# Altium schematic sheet 02-cpu+connect.SchDoc
size A4; SheetNumber: 3; SheetTotal: 4
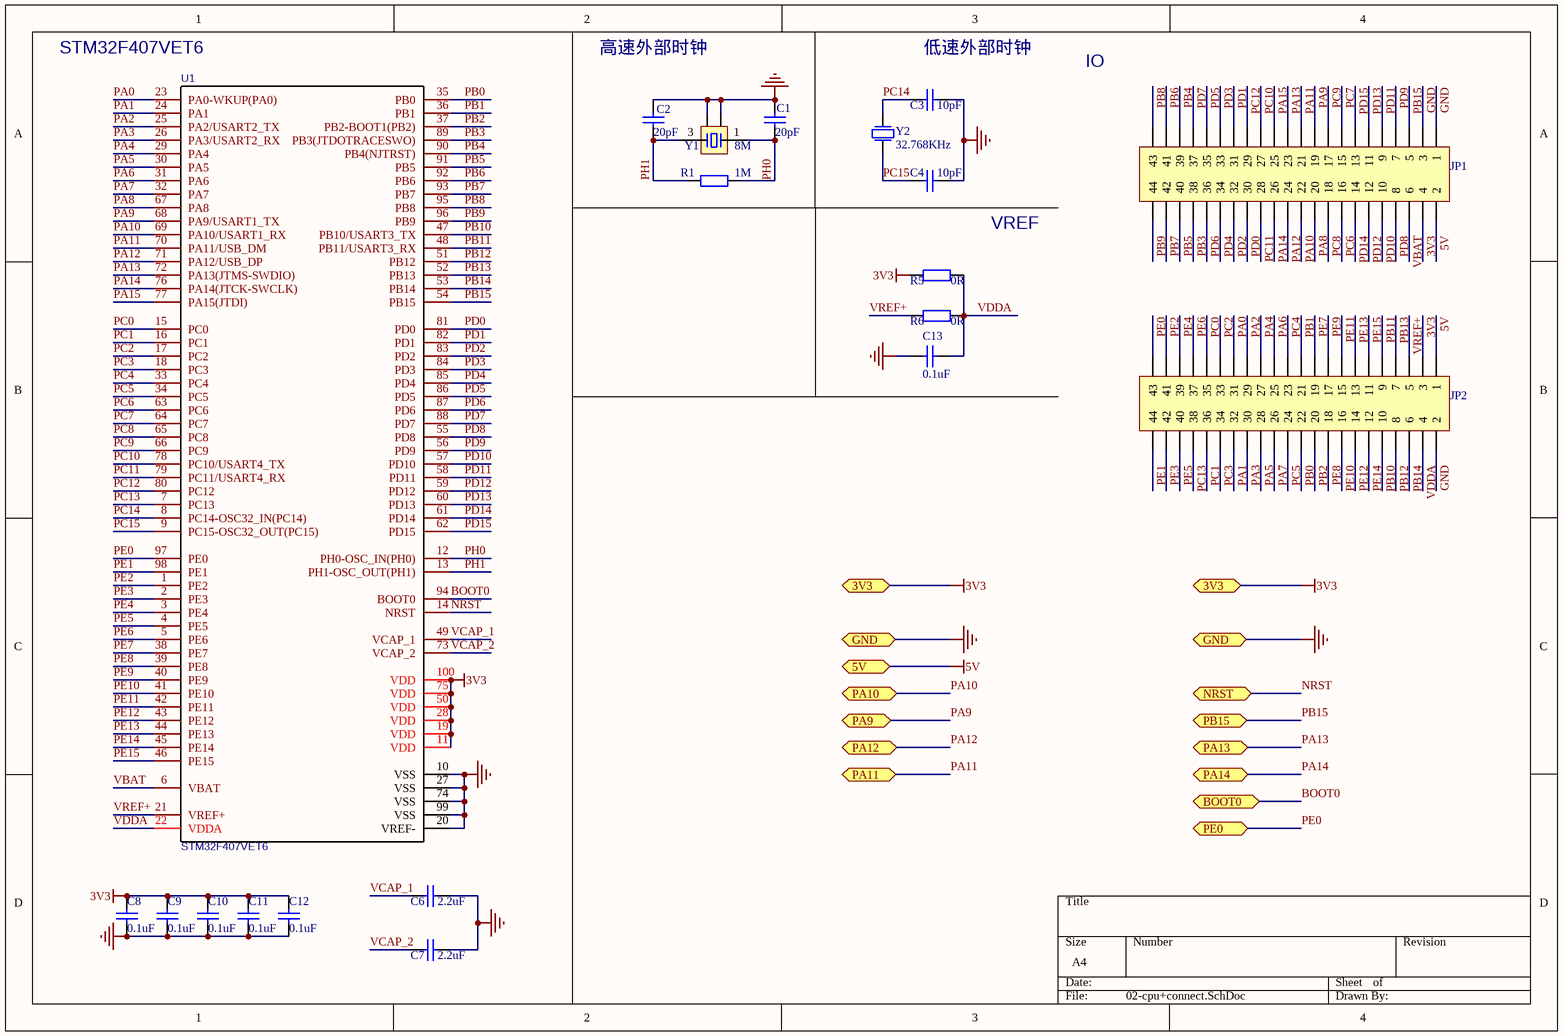
[diagram p0: 02-cpu+connect.SchDoc]

## Parts
C1  20pF  [C 0402_L]
C2  20pF  [C 0402_L]
C3  10pF  [C 0402_L]
C4  10pF  [C 0402_L]
C6  2.2uF  [C 0402_L]
C7  2.2uF  [C 0402_L]
C8  0.1uF  [C 0402_L]
C9  0.1uF  [C 0402_L]
C10  0.1uF  [C 0402_L]
C11  0.1uF  [C 0402_L]
C12  0.1uF  [C 0402_L]
C13  0.1uF  [C 0402_L]
JP1  Header 2x22  [HDR2.54-LI-2x22P]  (value not drawn)
JP2  Header 2x22  [HDR2.54-LI-2x22P]  (value not drawn)
R1  1M  [R 0402_L]
R5  0R  [R 0402_L]
R6  0R  [R 0402_L]
U1  STM32F407VET6  [LQFP100 14x14_N]
Y1  8M  [OSC 3225-4P]
Y2  32.768KHz  [FC135-3.2X1.5]

## Ports
3V3 (bidir, see Main[3A], 01-PWR[1A], 03-key+led+swd[1A]), 5V (bidir, see Main[3B], 01-PWR[1A]), BOOT0 (bidir, see Main[2B], 03-key+led+swd[1B]), GND (bidir, see Main[3A], 03-key+led+swd[1A]), NRST (bidir, see Main[2B], 03-key+led+swd[1B]), PA9 (bidir, see Main[2A], 01-PWR[1B]), PA10 (bidir, see Main[2A], 01-PWR[1A]), PA11 (bidir, see Main[2A], 01-PWR[1B]), PA12 (bidir, see Main[2A], 01-PWR[1B]), PA13 (bidir, see Main[2B], 03-key+led+swd[1B]), PA14 (bidir, see Main[2B], 03-key+led+swd[1B]), PB15 (bidir, see Main[2B], 03-key+led+swd[1B]), PE0 (bidir, see Main[2B], 03-key+led+swd[1B])

## Nets
3V3: C8.1 C9.1 C10.1 C11.1 C12.1 JP1.4 JP2.3 R5.2 U1.11(VDD) U1.19(VDD) U1.28(VDD) U1.50(VDD) U1.75(VDD) U1.100(VDD) ; port 3V3
5V: JP1.2 JP2.1 ; port 5V
GND: C1.1 C2.1 C3.1 C4.1 C6.1 C7.1 C8.2 C9.2 C10.2 C11.2 C12.2 C13.1 JP1.1 JP1.3 JP2.2 U1.10(VSS) U1.20(VREF-) U1.27(VSS) U1.74(VSS) U1.99(VSS) Y1.2 Y1.4 ; port GND
BOOT0: U1.94(BOOT0) ; port BOOT0
NRST: U1.14(NRST) ; port NRST
PA0: JP2.31 U1.23(PA0-WKUP(PA0))
PA1: JP2.32 U1.24(PA1)
PA2: JP2.29 U1.25(PA2/USART2_TX)
PA3: JP2.30 U1.26(PA3/USART2_RX)
PA4: JP2.27 U1.29(PA4)
PA5: JP2.28 U1.30(PA5)
PA6: JP2.25 U1.31(PA6)
PA7: JP2.26 U1.32(PA7)
PA8: JP1.20 U1.67(PA8)
PA9: JP1.19 U1.68(PA9/USART1_TX) ; port PA9
PA10: JP1.22 U1.69(PA10/USART1_RX) ; port PA10
PA11: JP1.21 U1.70(PA11/USB_DM) ; port PA11
PA12: JP1.24 U1.71(PA12/USB_DP) ; port PA12
PA13: JP1.23 U1.72(PA13(JTMS-SWDIO)) ; port PA13
PA14: JP1.26 U1.76(PA14(JTCK-SWCLK)) ; port PA14
PA15: JP1.25 U1.77(PA15(JTDI))
PB0: JP2.22 U1.35(PB0)
PB1: JP2.21 U1.36(PB1)
PB2: JP2.20 U1.37(PB2-BOOT1(PB2))
PB3: JP1.38 U1.89(PB3(JTDOTRACESWO))
PB4: JP1.39 U1.90(PB4(NJTRST))
PB5: JP1.40 U1.91(PB5)
PB6: JP1.41 U1.92(PB6)
PB7: JP1.42 U1.93(PB7)
PB8: JP1.43 U1.95(PB8)
PB9: JP1.44 U1.96(PB9)
PB10: JP2.10 U1.47(PB10/USART3_TX)
PB11: JP2.9 U1.48(PB11/USART3_RX)
PB12: JP2.8 U1.51(PB12)
PB13: JP2.7 U1.52(PB13)
PB14: JP2.6 U1.53(PB14)
PB15: JP1.5 U1.54(PB15) ; port PB15
PC0: JP2.35 U1.15(PC0)
PC1: JP2.36 U1.16(PC1)
PC2: JP2.33 U1.17(PC2)
PC3: JP2.34 U1.18(PC3)
PC4: JP2.23 U1.33(PC4)
PC5: JP2.24 U1.34(PC5)
PC6: JP1.16 U1.63(PC6)
PC7: JP1.15 U1.64(PC7)
PC8: JP1.18 U1.65(PC8)
PC9: JP1.17 U1.66(PC9)
PC10: JP1.27 U1.78(PC10/USART4_TX)
PC11: JP1.28 U1.79(PC11/USART4_RX)
PC12: JP1.29 U1.80(PC12)
PC13: JP2.38 U1.7(PC13)
PC14: C3.2 U1.8(PC14-OSC32_IN(PC14)) Y2.1(P1)
PC15: C4.2 U1.9(PC15-OSC32_OUT(PC15)) Y2.2(P2)
PD0: JP1.30 U1.81(PD0)
PD1: JP1.31 U1.82(PD1)
PD2: JP1.32 U1.83(PD2)
PD3: JP1.33 U1.84(PD3)
PD4: JP1.34 U1.85(PD4)
PD5: JP1.35 U1.86(PD5)
PD6: JP1.36 U1.87(PD6)
PD7: JP1.37 U1.88(PD7)
PD8: JP1.8 U1.55(PD8)
PD9: JP1.7 U1.56(PD9)
PD10: JP1.10 U1.57(PD10)
PD11: JP1.9 U1.58(PD11)
PD12: JP1.12 U1.59(PD12)
PD13: JP1.11 U1.60(PD13)
PD14: JP1.14 U1.61(PD14)
PD15: JP1.13 U1.62(PD15)
PE0: JP2.43 U1.97(PE0) ; port PE0
PE1: JP2.44 U1.98(PE1)
PE2: JP2.41 U1.1(PE2)
PE3: JP2.42 U1.2(PE3)
PE4: JP2.39 U1.3(PE4)
PE5: JP2.40 U1.4(PE5)
PE6: JP2.37 U1.5(PE6)
PE7: JP2.19 U1.38(PE7)
PE8: JP2.18 U1.39(PE8)
PE9: JP2.17 U1.40(PE9)
PE10: JP2.16 U1.41(PE10)
PE11: JP2.15 U1.42(PE11)
PE12: JP2.14 U1.43(PE12)
PE13: JP2.13 U1.44(PE13)
PE14: JP2.12 U1.45(PE14)
PE15: JP2.11 U1.46(PE15)
PH0: C1.2 R1.1 U1.12(PH0-OSC_IN(PH0)) Y1.1
PH1: C2.2 R1.2 U1.13(PH1-OSC_OUT(PH1)) Y1.3
VBAT: JP1.6 U1.6(VBAT)
VCAP_1: C6.2 U1.49(VCAP_1)
VCAP_2: C7.2 U1.73(VCAP_2)
VDDA: C13.2 JP2.4 R5.1 R6.1 U1.22(VDDA)
VREF+: JP2.5 R6.2 U1.21(VREF+)

## Notes on the sheet
- (near U1) STM32F407VET6
- 高速外部时钟
- (near C3) 低速外部时钟
- IO
- VREF

## Library data of the parts
C1-C4 C6-C13 = Cap
JP1 JP2 = Header 2x22: 2x22P接插件; BOM名称: 20*2P接插件
R1 R5 R6 = Res
U1 = STM32F407VET6: BOM_Manufacturer: ST; subpart_no: 1; tags: STM32; BOM_Supplier Part: C28730; BOM_Supplier: LCSC; BOM_Manufacturer Part: STM32F407VET6; image: http://image.lceda.cn/szlcsc/C28730.jpg; spicePre: U; spiceSymbolName: STM32F407VET6
Y1 = XTAL-4P: 4脚无源晶振; 负载电容: CL20pF; BOM名称: 4脚无源晶振
Y2 = XTAL-2P: vaule: 32.768KHz